# EasyEDA schematic SCH_Eda_Start_2021-09-03.json
TITLE: Sheet_1; REV: 1.0; Date: 2021-09-03; Sheet: 1/1; Drawn By: Sare Ins; Company: Your Company
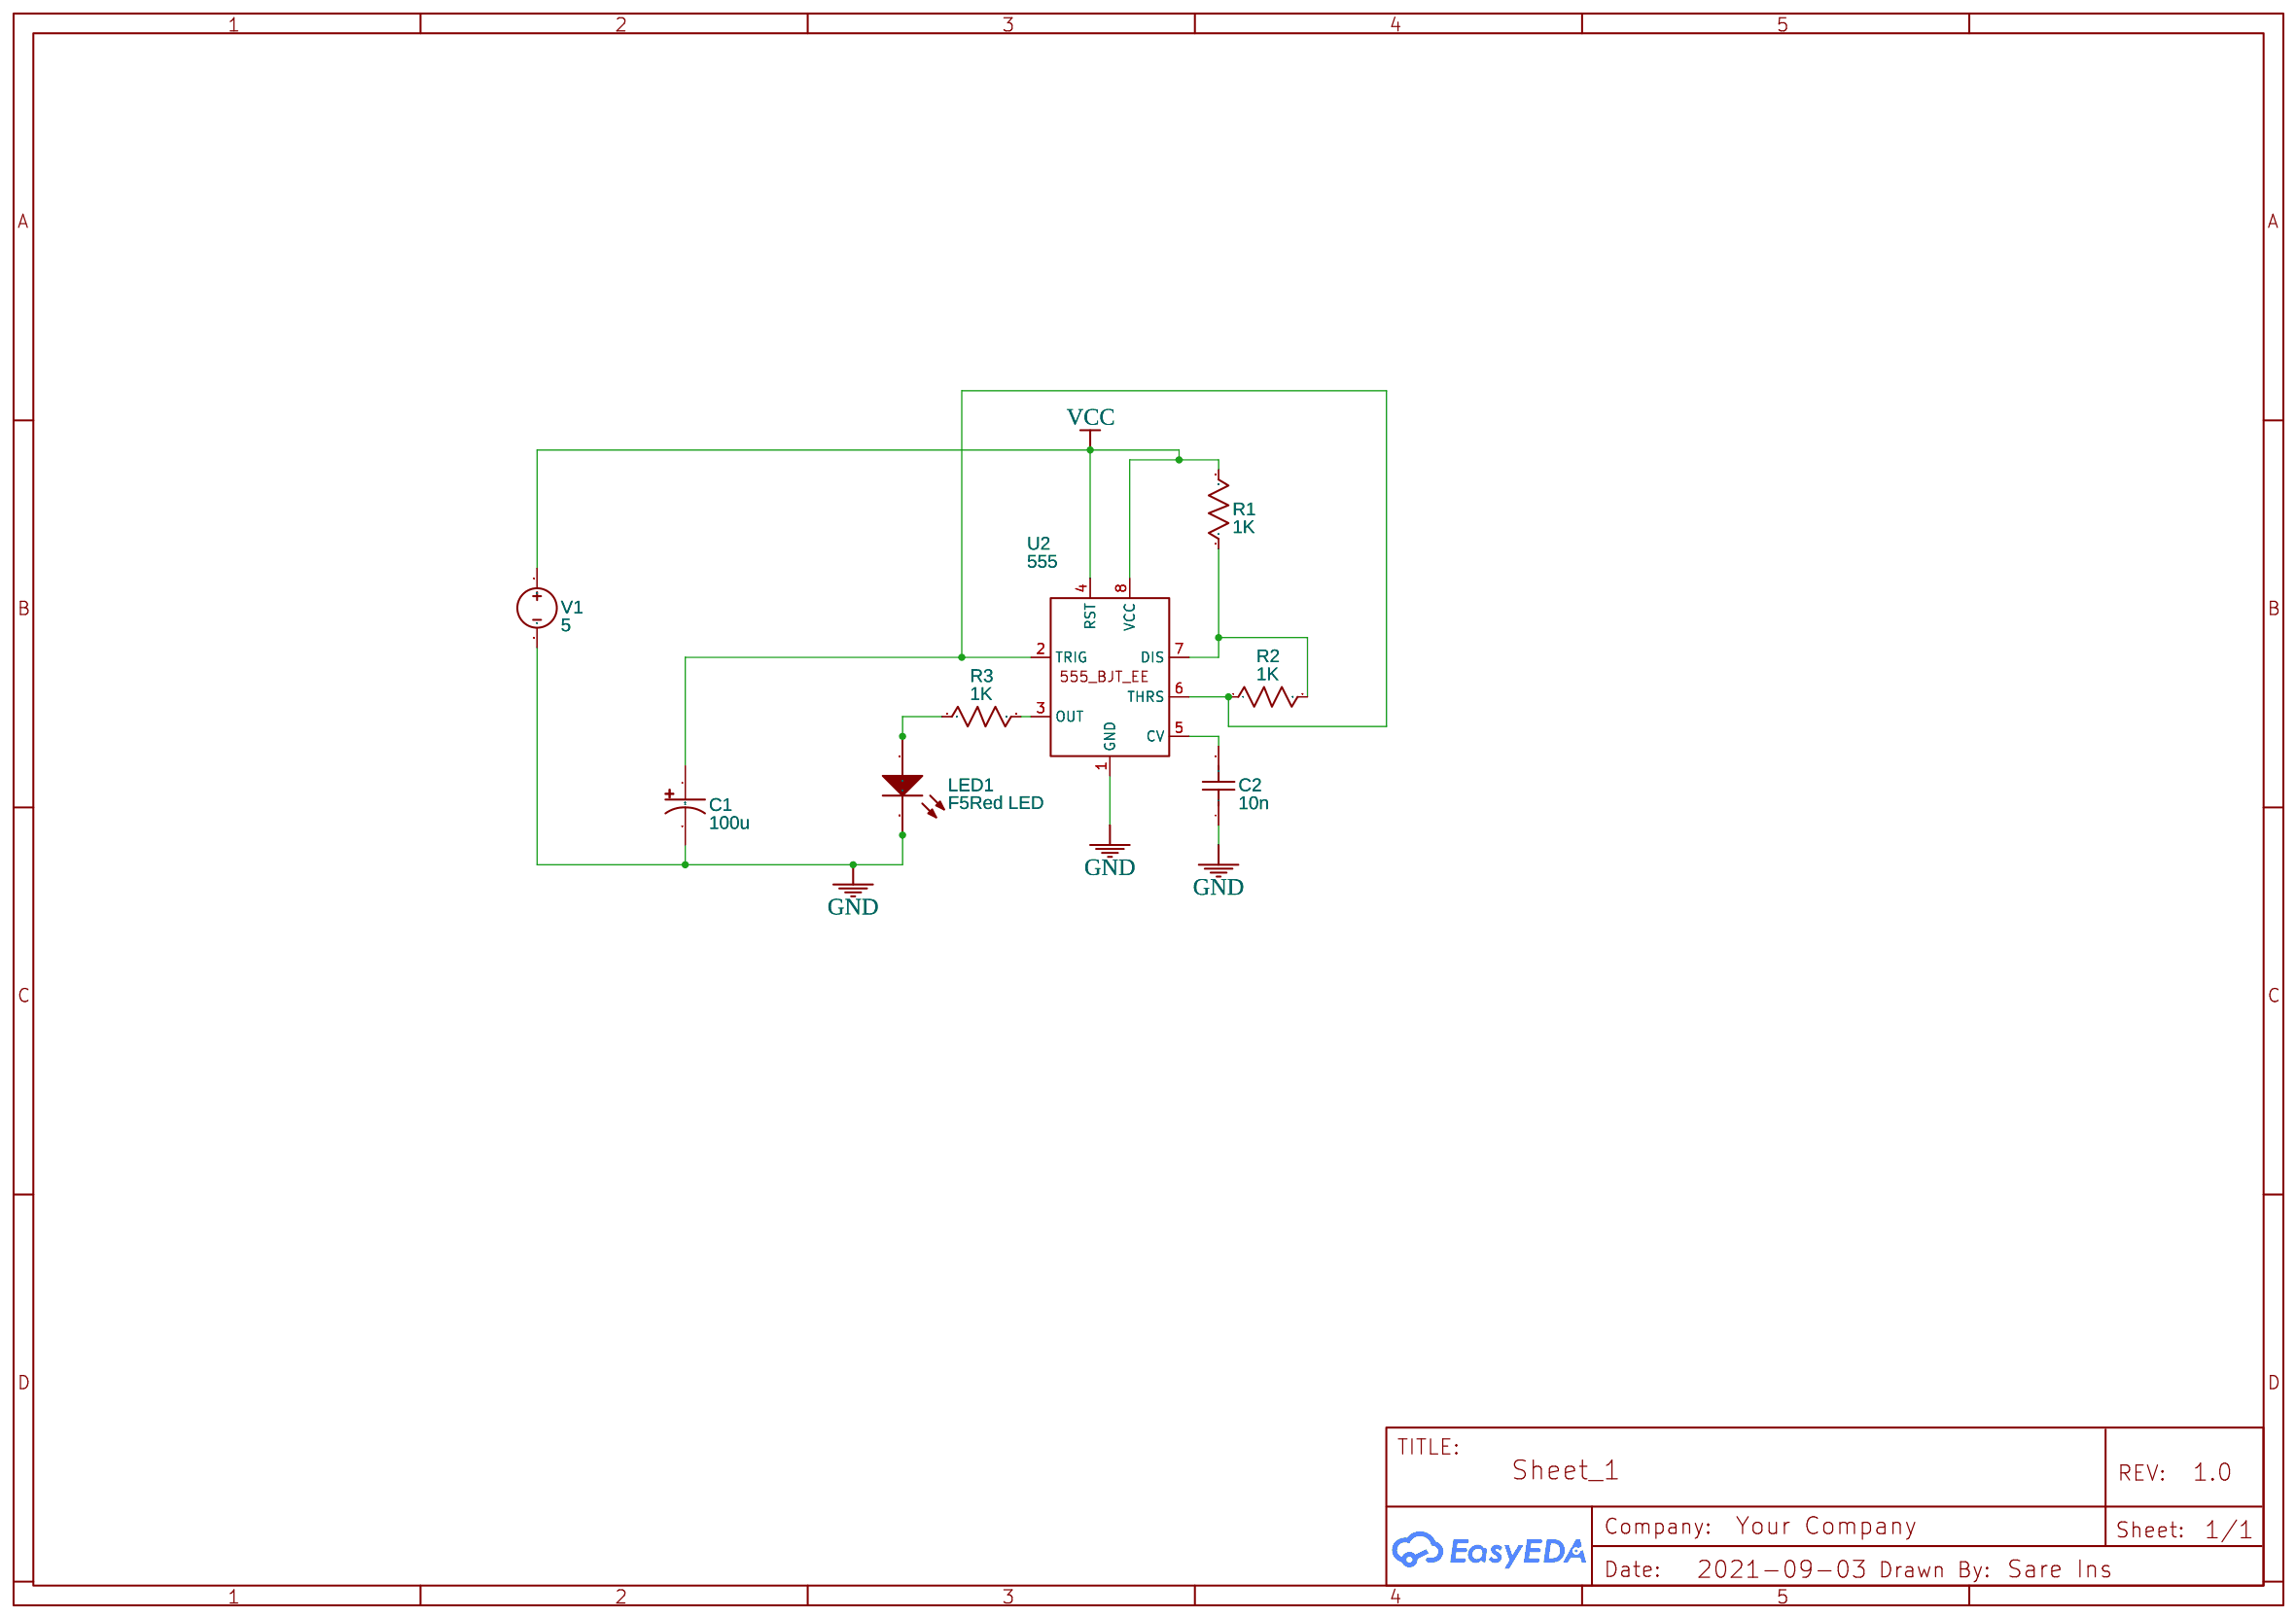
[diagram p0: schematic sheet]

## Parts
C1  100u  [CAP-D3.0XF1.5]
C2  10n  [RAD-0.1]
LED1  F5Red LED  [LED-TH_F5]
R1  1K  [AXIAL-0.3]
R2  1K  [AXIAL-0.3]
R3  1K  [AXIAL-0.3]
U2  555  [DIP8]
V1  5  [HDR1X2]

## Library data of the parts
C1 = Capacitor_Electrolytic_US: Supplier: YUJING; Contributor: EasyEDA; Capacitance: 1u
C2 = Capacitor_US: Contributor: EasyEDA; Supplier: YUJING; Capacitance: 1u
LED1 = F5Red LED: Supplier: LCSC; Manufacturer: ReliaPro; Supplier Part: C10500
R1-R3 = Resistor_US: Resistance: 1k; Contributor: EasyEDA; Supplier: YUJING
U2 = 555_BJT_EE: Contributor: EasyEDA; link: http://www.ti.com/lit/ds/symlink/ne555.pdf
V1 = VDC: Contributor: EasyEDA; sim: true

## Nets
GND: C1.2 C2.1 LED1.1(k) LED1.2(K) U2.1(GND) V1.2
VCC: R1.2 U2.4(RST) U2.8(VCC) V1.1
Net-(C1-1): C1.1 R2.1 U2.2(TRIG) U2.6(THRS)
Net-(C2-2): C2.2 U2.5(CV)
Net-(LED1-3): LED1.3(A) LED1.4(A) R3.1
Net-(R1-1): R1.1 R2.2 U2.7(DIS)
Net-(R3-2): R3.2 U2.3(OUT)
